# EAGLE schematic Wisp v04 (EAGLE 6.5.0)
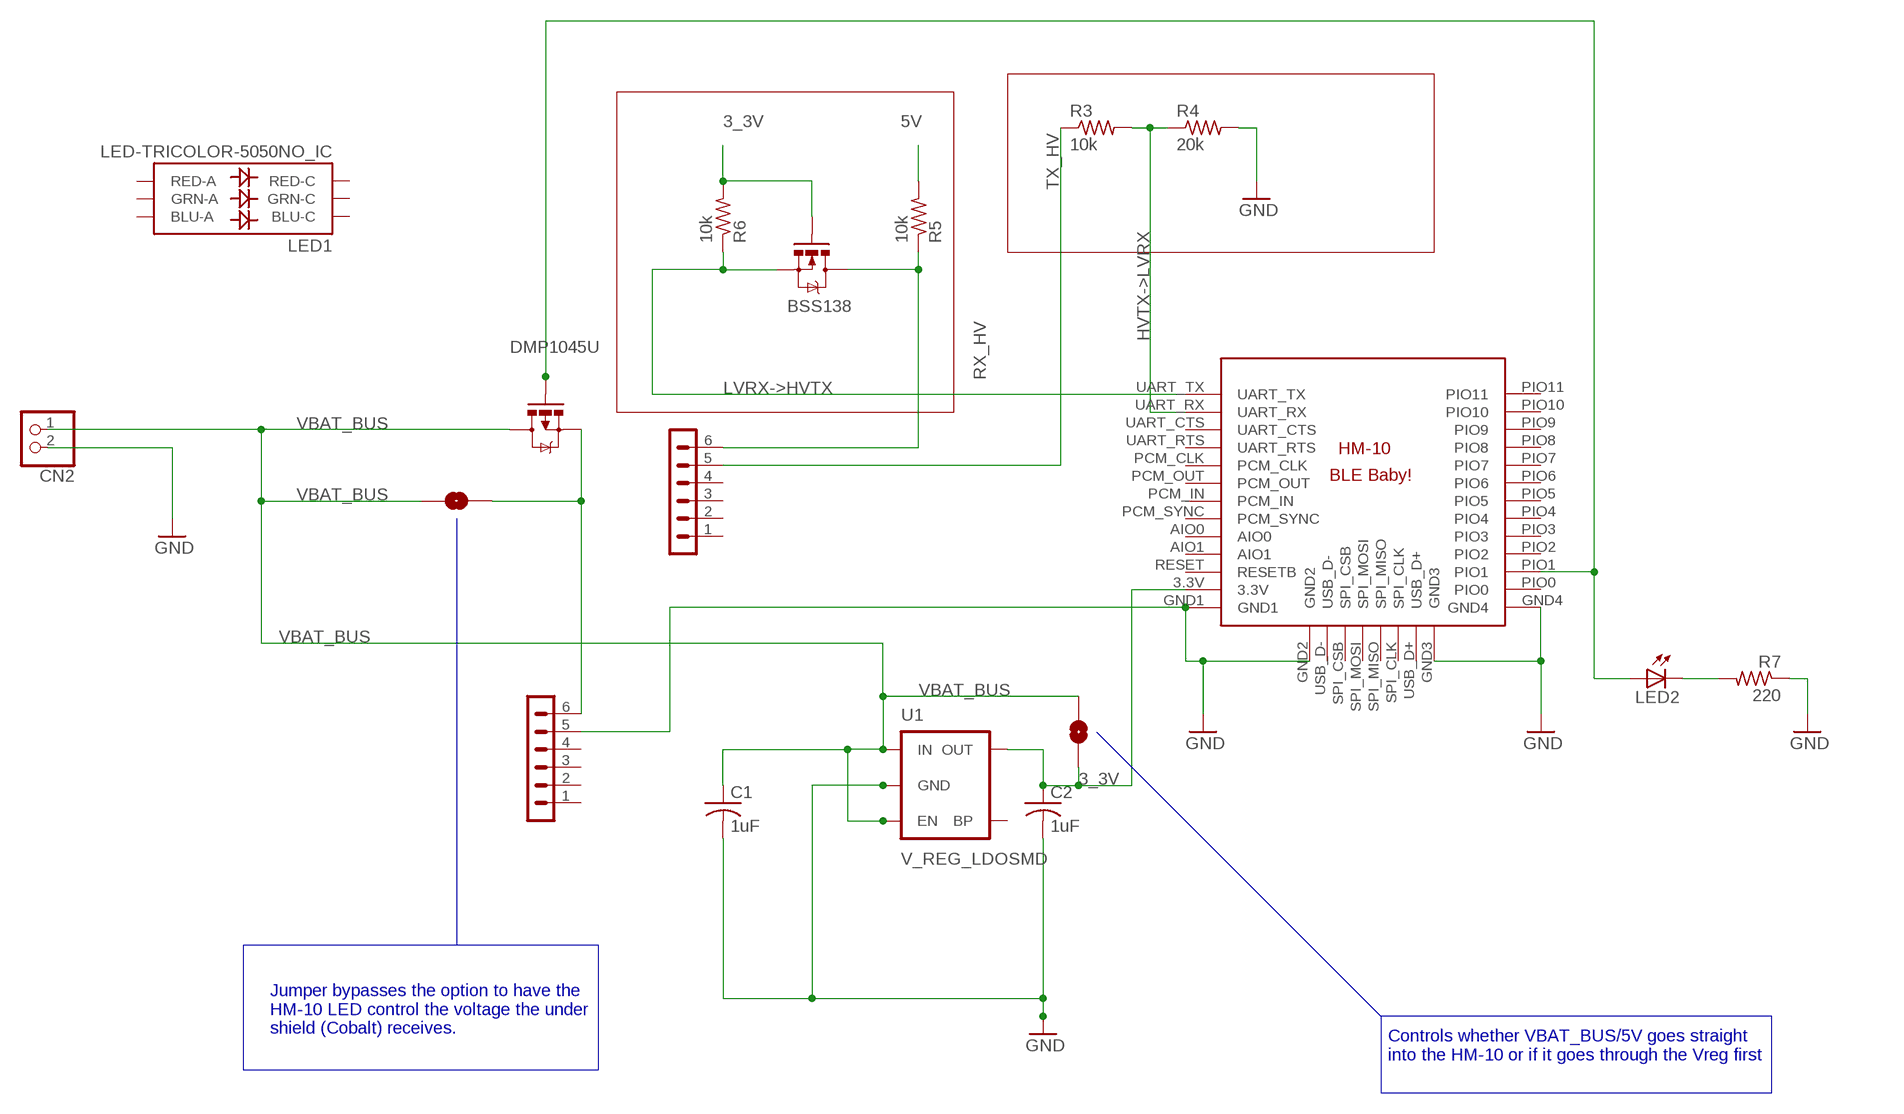
[diagram p0: schematic, sheet 1]

## Parts
BSS138  MOSFET-NCHANNELSMD  [SOT23-3]
C1  1uF  C-USC0805K  [C0805K]
C2  1uF  C-USC0805K  [C0805K]
CN2  JST_2PIN-THM  [JST-PH-2-THM]
DMP1045U  MOSFET-PCHANNELSMD  [SOT23-3]
LED1  LED-TRICOLOR-5050NO_IC  [LED-TRICOLOR-5050]
LED2  LED0603  [LED-0603]
R3  10k  R-US_R0402  [R0402]
R4  20k  R-US_R0402  [R0402]
R5  10k  R-US_R0402  [R0402]
R6  10k  R-US_R0402  [R0402]
R7  220  R-US_R0402  [R0402]
SJ1  SOLDERJUMPERNO  [SJ_2S-NO]
SJ2  SOLDERJUMPERNO  [SJ_2S-NO]
U1  V_REG_LDOSMD  [SOT23-5]
U$1  BLE-HM-10  [BLE-HM-10]
U$4  1X6_SHORT_ROUND  [1X6_SHORT_ROUND]
U$5  1X6_SHORT_ROUND  [1X6_SHORT_ROUND]

## Nets
3_3V: BSS138.1(G) C2.1 R6.2 SJ1.1 U1.5(OUT) U$1.3.3V
5V: R5.2
GND: C1.2 C2.2 CN2.2 R4.2 R7.1 U1.2(GND) U$1.GND1 U$1.GND2 U$1.GND3 U$1.GND4 U$5.5
HVTX->LVRX: R3.2 R4.1 U$1.UART_RX
LVRX->HVTX: BSS138.2(S) R6.1 U$1.UART_TX
N$1: DMP1045U.2(S) SJ2.1 U$5.6
N$2: DMP1045U.1(G) LED2.A U$1.PIO1
N$26: LED2.C R7.2
RX_HV: BSS138.3(D) R5.1 U$4.6
TX_HV: R3.1 U$4.5
VBAT_BUS: C1.1 CN2.1 DMP1045U.3(D) SJ1.2 SJ2.2 U1.1(IN) U1.3(EN)
Unconnected: LED1.1(GRN-A) LED1.2(RED-A) LED1.3(BLU-A) LED1.4(BLU-C) LED1.5(RED-C) LED1.6(GRN-C) U1.4(BP) U$1.AIO0 U$1.AIO1 U$1.PCM_CLK U$1.PCM_IN U$1.PCM_OUT U$1.PCM_SYNC U$1.PIO0 U$1.PIO2 U$1.PIO3 U$1.PIO4 U$1.PIO5 U$1.PIO6 U$1.PIO7 U$1.PIO8 U$1.PIO9 U$1.PIO10 U$1.PIO11 U$1.RESET(RESETB) U$1.SPI_CLK U$1.SPI_CSB U$1.SPI_MISO U$1.SPI_MOSI U$1.UART_CTS U$1.UART_RTS U$1.USB_D+ U$1.USB_D- U$4.1 U$4.2 U$4.3 U$4.4 U$5.1 U$5.2 U$5.3 U$5.4

## Buses
B$1
B$2

## Notes on the sheet
- Jumper bypasses the option to have the 
  HM-10 LED control the voltage the under 
  shield (Cobalt) receives.
- Controls whether VBAT_BUS/5V goes straight
  into the HM-10 or if it goes through the Vreg first

## Library data of the parts
BSS138 = SparkFun:MOSFET-NCHANNEL
C1 C2 = resistor:C-US: CAPACITOR, American symbol
CN2 = adafruit:JST_2PIN: JST 2-Pin Connectors of various flavors SMT-RA (S2B-PH-SM4) 4UConnector #17311 SMT (B2B-PH-SM4) THM-RA (S2B-PH) THM (B2B-PH)
DMP1045U = SparkFun-DiscreteSemi:MOSFET-PCHANNEL: Generic PMOSFET
LED1 = SparkFun-LED:LED-TRICOLOR-5050
LED2 = SparkFun:LED: LEDs Standard schematic elements and footprints for 5mm, 3mm, 1206, and 0603 sized LEDs. 5mm - Spark Fun Electronics SKU : COM-00529 (and others)
R3-R7 = resistor:R-US_: RESISTOR, American symbol
SJ1 SJ2 = SparkFun:SOLDERJUMPER: Solder Jumper Standard SMD solder jumper. Used to automate production. Two varients : Normally Open and Normally Closed are the same, but have different paste layers. NC will have a large amount of paste and should jumper during reflow.
U1 = SparkFun:V_REG_LDO: Voltage Regulator LDO Standard 150mA LDO voltage regulator in SOT-23 layout. Micrel part MIC5205. BP (by-pass) pin is used to lower output noise with 470pF cap.
U$1 = Random parts:BLE-HM-10
U$4 U$5 = Random parts(01-14-14):1X6_SHORT_ROUND